# EAGLE design PCB-AuxControl (EAGLE 9.5.2)
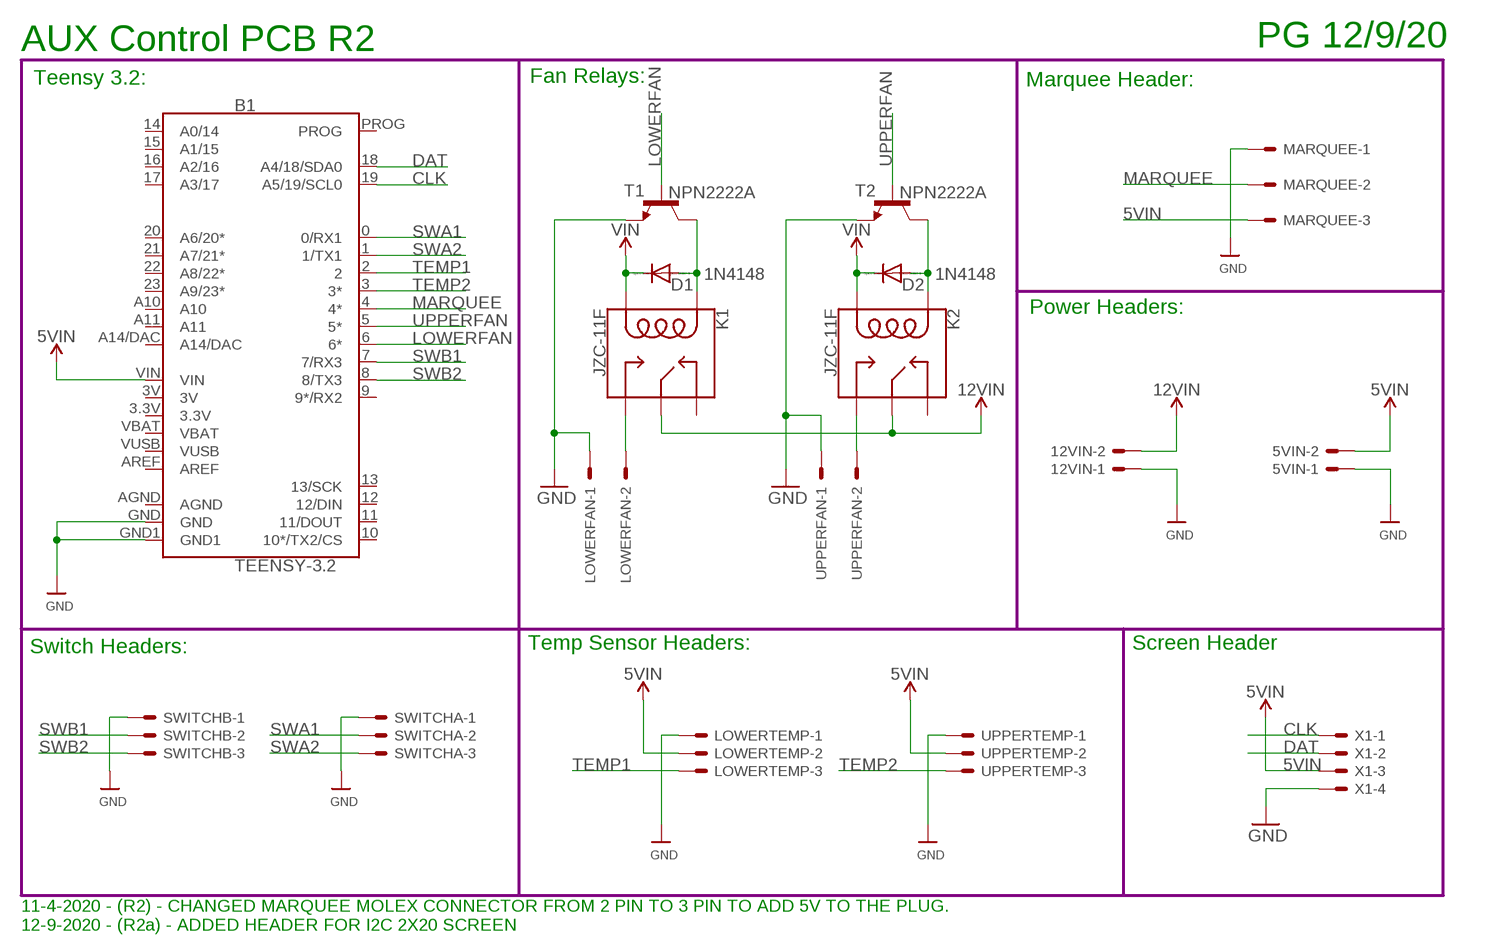
[diagram p0: schematic, sheet 1]

## Parts
5VIN  KK-156-2  [KK-156-2]
12VIN  KK-156-2  [KK-156-2]
B1  TEENSY-3.2  TEENSY-3.1SILK  [TEENSY-3.1]
D1  1N4148  1N4148DO35-7  [DO35-7]
D2  1N4148  1N4148DO35-7  [DO35-7]
K1  JZC-11F  RELAY-SPDT-JZC-11F  [RELAY-JZC]
K2  JZC-11F  RELAY-SPDT-JZC-11F  [RELAY-JZC]
LOWERFAN  KK-156-2  [KK-156-2]
LOWERTEMP  KK-156-3  [KK-156-3]
MARQUEE  KK-156-3  [KK-156-3]
SWITCHA  KK-156-3  [KK-156-3]
SWITCHB  KK-156-3  [KK-156-3]
T1  NPN2222A  BC337  [TO92]
T2  NPN2222A  BC337  [TO92]
UPPERFAN  KK-156-2  [KK-156-2]
UPPERTEMP  KK-156-3  [KK-156-3]
X1  KK-156-4  [KK-156-4]

## Nets
5VIN: 5VIN.2 B1.VIN D1.C D2.C K1.1(COIL2) K2.1(COIL2) LOWERTEMP.2 MARQUEE.3 UPPERTEMP.2 X1.3 ; supply symbol labelled VIN
12VIN: 12VIN.2 K1.4(MAIN) K2.4(MAIN)
CLK: B1.19(A5/19/SCL0) X1.1
DAT: B1.18(A4/18/SDA0) X1.2
GND: 5VIN.1 12VIN.1 B1.GND B1.GND1 LOWERFAN.1 LOWERTEMP.1 MARQUEE.1 SWITCHA.1 SWITCHB.1 T1.1(E) T2.1(E) UPPERFAN.1 UPPERTEMP.1 X1.4
LOWERFAN: B1.6(6*) T1.2(B)
MARQUEE: B1.4(4*) MARQUEE.2
N$3: K2.3(NO) UPPERFAN.2
N$4: K1.3(NO) LOWERFAN.2
RELAY1: D1.A K1.5(COIL1) T1.3(C)
RELAY2: D2.A K2.5(COIL1) T2.3(C)
SWA1: B1.0(0/RX1) SWITCHA.2
SWA2: B1.1(1/TX1) SWITCHA.3
SWB1: B1.7(7/RX3) SWITCHB.2
SWB2: B1.8(8/TX3) SWITCHB.3
TEMP1: B1.2 LOWERTEMP.3
TEMP2: B1.3(3*) UPPERTEMP.3
UPPERFAN: B1.5(5*) T2.2(B)
Unconnected: B1.9(9*/RX2) B1.10(10*/TX2/CS) B1.11(11/DOUT) B1.12(12/DIN) B1.13(13/SCK) B1.14(A0/14) B1.15(A1/15) B1.16(A2/16) B1.17(A3/17) B1.20(A6/20*) B1.21(A7/21*) B1.22(A8/22*) B1.23(A9/23*) B1.A10 B1.A11 B1.A14/DAC B1.AREF B1.PROG K1.2(NC) K2.2(NC)

## Notes on the sheet
- AUX Control PCB R2 | PG 12/9/20
- Teensy 3.2: | Fan Relays: | Marquee Header:
- Power Headers:
- Switch Headers: | Temp Sensor Headers: | Screen Header
- 11-4-2020 - (R2) - CHANGED MARQUEE MOLEX CONNECTOR FROM 2 PIN TO 3 PIN TO ADD 5V TO THE PLUG.
  12-9-2020 - (R2a) - ADDED HEADER FOR I2C 2X20 SCREEN

## Power pins joined to a net without a drawn wire
3.3V: B1.3.3V
3V: B1.3V
AGND: B1.AGND
VBAT: B1.VBAT
VUSB: B1.VUSB

## Library data of the parts
5VIN 12VIN LOWERFAN UPPERFAN = con-molex:KK-156-2: KK 156 HEADER Source: http://www.molex.com/pdm_docs/sd/026604100_sd.pdf; MF: MOLEX; OC_FARNELL: unknown; OC_NEWARK: unknown
B1 = SparkFun-Boards:TEENSY-3.1: Teensy 3+ Footprint Mechanical footprint with connectors for Teensy Development Board with ARM Cortex. SparkFun Products: Teensy 3.2 <https://www.sparkfun.com/products/13736> Teensy LC <https://www.sparkfun.com/products/13305>; SF_ID: DEV-12646
D1 D2 = diode:1N4148: DIODE high speed (Philips)
K1 K2 = SparkFun-Electromechanical:RELAY-SPDT: SPDT Electromechanical Relay Single-pole, double-throw sealed relays. When current is applied to the coil, it throws a simple changeover switch, terminating the connection from the NC contact to ground and closing the NO contact. Use them to switch high voltage/high current devices. SparkFun Products JQX-15F: Relay SPDT Sealed - 20A <https://www.sparkfun.com/products/10924> (COM-10924) JZC-11F: Relay SPDT Sealed <https://www.sparkfun.com/products/100> (COM-00100); PROD_ID: COMP-09533; SF_SKU: COM-00100
LOWERTEMP MARQUEE SWITCHA SWITCHB UPPERTEMP = con-molex:KK-156-3: KK 156 HEADER Source: http://www.molex.com/pdm_docs/sd/026604100_sd.pdf; MF: MOLEX; OC_FARNELL: unknown; OC_NEWARK: unknown
T1 T2 = transistor:BC337: NPN TRANSISTOR
X1 = con-molex:KK-156-4: KK 156 HEADER Source: http://www.molex.com/pdm_docs/sd/026604100_sd.pdf; MF: MOLEX; OC_FARNELL: unknown; OC_NEWARK: unknown

## Board
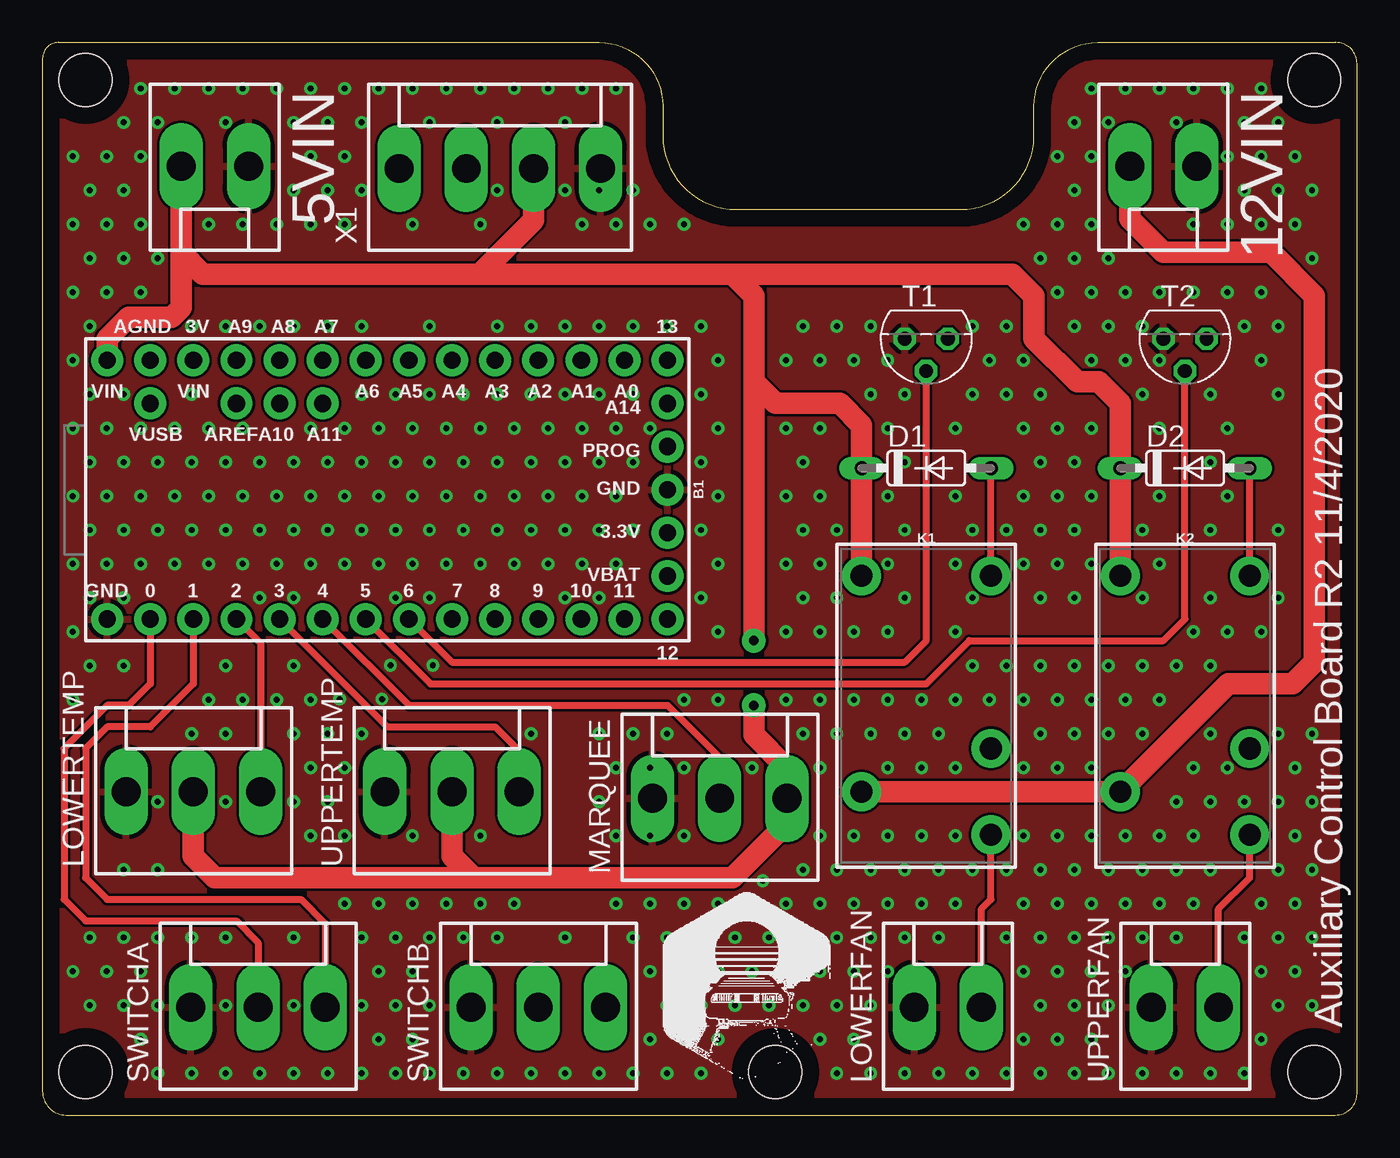
[diagram p1: board, top side]
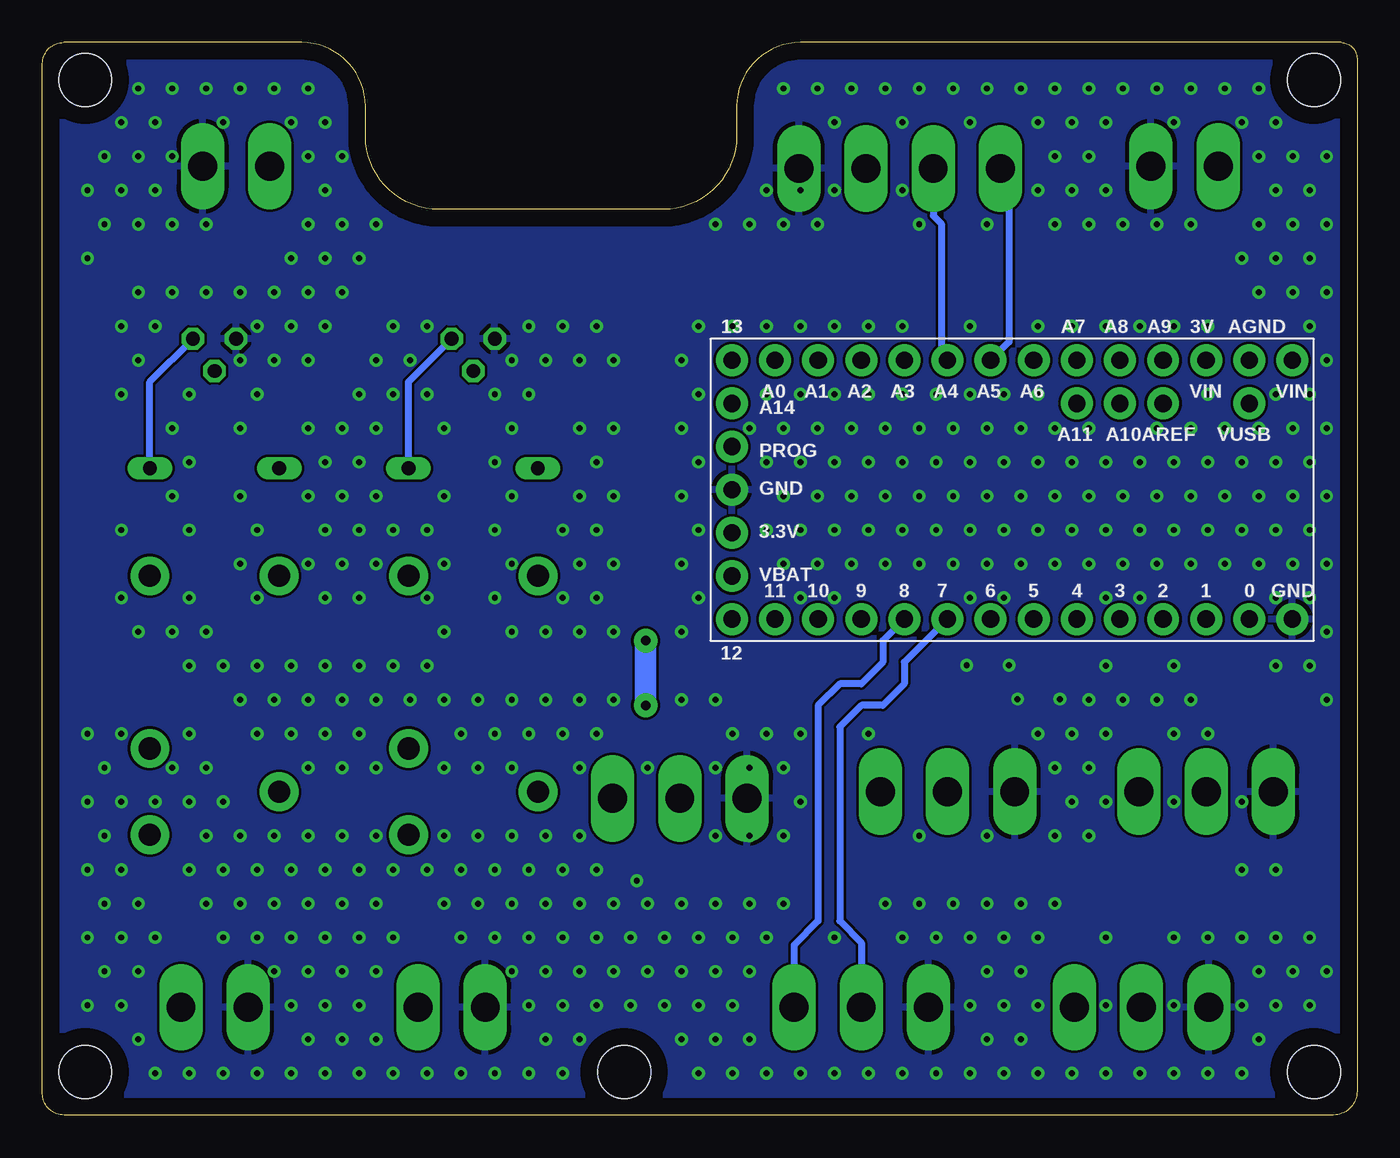
[diagram p2: board, bottom side, seen from below]

Size 77.45 x 63.17 mm. Coordinates in mm from the lower left corner, seen from the top.
Outline: 0,62.23 0,1.4 arc90 1.4,0 76.18,0 arc90 77.45,1.27 77.45,61.92 arc90 76.2,63.17 62.17,63.17 arc90 58.42,59.41 58.42,57.68 arc-90 54.08,53.34 40.89,53.34 arc-90 36.55,57.68 36.55,59.41 arc90 32.8,63.17 0.94,63.17 arc90 0,62.23
Copper layers (1*16): Top 0.035mm / dielectric 1.5mm / Bottom 0.035mm
Design rules "default": minimum track width 6mil, minimum drill 0.35mm, track to track 6mil, track to pad 6mil, pad to pad 6mil, via to via 6mil, smd to smd 6mil, copper to edge 40mil, drill to drill 6mil, minimum pad ring 10mil, minimum via ring 8mil, stop-mask expansion 4mil, vias tented up to drill 0.5mm, thermal gap 10mil
Holes 3.1 mm at 2.54,2.54 74.93,2.54 74.93,60.96 2.54,60.96 43.18,2.54

### Footprints (pad centres in the part's own frame; a part is rotated, then mirrored left to right if it is on the bottom)
KK-156-2 = drill 1.7 pad 2.184 long: 1 -1.98,0; 2 1.98,0
TEENSY-3.1 = drill 1.016 pad 1.88: 0 7.62,-13.97; 1 7.62,-11.43; 2 7.62,-8.89; 3 7.62,-6.35; 3.3V 2.54,16.51; 3V -7.62,-11.43; 4 7.62,-3.81; 5 7.62,-1.27; 6 7.62,1.27; 7 7.62,3.81; 8 7.62,6.35; 9 7.62,8.89; 10 7.62,11.43; 11 7.62,13.97; 12 7.62,16.51; 13 -7.62,16.51; 14 -7.62,13.97; 15 -7.62,11.43; 16 -7.62,8.89; 17 -7.62,6.35; 18 -7.62,3.81; 19 -7.62,1.27; 20 -7.62,-1.27; 21 -7.62,-3.81; 22 -7.62,-6.35; 23 -7.62,-8.89; A10 -5.08,-6.35; A11 -5.08,-3.81; A14/DAC -5.08,16.51; AGND -7.62,-13.97; AREF -5.08,-8.89; GND 0,16.51; GND1 7.62,-16.51; PROG -2.54,16.51; VBAT 5.08,16.51; VIN -7.62,-16.51; VUSB -5.08,-13.97
DO35-7 = drill 0.813 long: A 3.81,0; C -3.81,0
RELAY-JZC = drill 1.3 pad 2.286: 1 3.81,-8.89; 2 -3.81,1.27; 3 -3.81,6.35; 4 3.81,3.81; 5 -3.81,-8.89
KK-156-3 = drill 1.7 pad 2.184 long: 1 -3.96,0; 2 0,0; 3 3.96,0
TO92 = drill 0.813 octagon: 1 1.27,0; 2 0,1.905; 3 -1.27,0
KK-156-4 = drill 1.7 pad 2.184 long: 1 -5.94,0; 2 -1.98,0; 3 1.98,0; 4 5.94,0

### Placement (x,y rotation side)
5VIN  10.16,55.88 180 top
12VIN  66.04,55.88 180 top
B1  20.32,36.83 270 top
D1  52.07,38.1 0 top
D2  67.31,38.1 0 top
K1  52.07,22.86 180 top
K2  67.31,22.86 180 top
LOWERFAN  53.34,6.35 0 top
LOWERTEMP  8.89,19.05 0 top
MARQUEE  39.9,18.65 0 top
SWITCHA  12.7,6.35 0 top
SWITCHB  29.21,6.35 0 top
T1  52.07,45.72 180 top
T2  67.31,45.72 180 top
UPPERFAN  67.31,6.35 0 top
UPPERTEMP  24.13,19.05 0 top
X1  26.95,55.75 0 top

### Tracks (layer width: path | path; a pad name or v marks a point on that pad's centre or on a via)
5VIN  (via drill 0.55 pad 1.4)
  Top 1.27: K2.1 D2.C 63.5,41.91 62.23,43.18 60.96,43.18 58.42,45.72 58.42,48.26 57.15,49.53 40.64,49.53 | K1.1 D1.C 48.26,40.64 46.99,41.91 43.18,41.91 41.91,43.18 | 25.4,13.97 40.64,13.97 43.86,17.19 MARQUEE.3 43.86,20.44 41.91,22.39 v41.91,24.13 | 25.4,13.97 10.16,13.97 8.89,15.24 LOWERTEMP.2 | 41.91,43.18 v41.91,27.94 | 40.64,49.53 41.91,48.26 41.91,43.18 | B1.VIN 3.81,45.72 5.08,46.99 7.62,46.99 8.18,47.55 8.18,50.8 | 5VIN.2 8.18,50.8 | 8.18,50.8 9.45,49.53 25.75,49.53 | 25.75,49.53 40.64,49.53 | UPPERTEMP.2 24.13,15.24 25.4,13.97 | 25.75,49.53 28.93,52.71 X1.3
  Bottom 1.27: v41.91,27.94 v41.91,24.13
12VIN
  Top 1.27: K1.4 K2.4 69.85,25.4 73.66,25.4 74.93,26.67 74.93,48.26 72.39,50.8 66.04,50.8 64.06,52.78 12VIN.2
CLK
  Bottom 0.406: X1.1 21.01,54.26 20.5,53.75 20.5,45.54 B1.19
DAT
  Bottom 0.406: X1.2 24.97,52.97 24.5,52.5 24.5,44.82 B1.18
GND  (via drill 0.35)
  other vias: 42.44,13.8 2.8,6.46 1.8,8.46 2.8,10.46 1.8,24.46 2.8,26.46 1.8,28.46 2.8,30.46 1.8,32.46 2.8,34.46 1.8,36.46 2.8,38.46 1.8,40.46 2.8,42.46 1.8,44.46 2.8,46.46 1.8,48.46 2.8,50.46 1.8,52.46 2.8,54.46 1.8,56.46 4.8,6.46 3.8,8.46 4.8,10.46 4.8,14.46 4.8,26.46 4.8,30.46 3.8,32.46 4.8,34.46 3.8,36.46 4.8,38.46 3.8,40.46 4.8,42.46 3.8,48.46 4.8,50.46 3.8,52.46 4.8,54.46 3.8,56.46 4.8,58.46 6.8,2.46 5.8,4.46 6.8,6.46 5.8,8.46 6.8,10.46 6.8,14.46 6.8,18.46 5.8,32.46 6.8,34.46 5.8,36.46 6.8,38.46 5.8,40.46 5.8,48.46 6.8,50.46 5.8,52.46 5.8,56.46 6.8,58.46 5.8,60.46 8.8,2.46 8.8,10.46 8.8,22.46 7.8,32.46 8.8,34.46 7.8,36.46 8.8,38.46 7.8,40.46 8.8,42.46 8.8,46.46 7.8,60.46 10.8,2.46 10.8,6.46 10.8,10.46 10.8,18.46 10.8,22.46 9.8,24.46 10.8,26.46 9.8,32.46 10.8,34.46 9.8,36.46 10.8,38.46 9.8,40.46 10.8,46.46 9.8,52.46 10.8,58.46 9.8,60.46 12.8,2.46 11.8,24.46 12.8,30.46 11.8,32.46 12.8,34.46 11.8,36.46 12.8,38.46 11.8,40.46 12.8,46.46 11.8,52.46 11.8,60.46 14.8,2.46 14.8,6.46 14.8,10.46 14.8,18.46 14.8,22.46 13.8,24.46 14.8,26.46 14.8,30.46 13.8,32.46 14.8,34.46 13.8,36.46 14.8,38.46 14.8,46.46 13.8,52.46 14.8,54.46 14.8,58.46 13.8,60.46 16.8,2.46 15.8,16.46 16.8,18.46 15.8,20.46 16.8,22.46 15.8,24.46 15.8,32.46 16.8,34.46 15.8,36.46 16.8,38.46 15.8,40.46 16.8,46.46 15.8,52.46 16.8,54.46 15.8,56.46 16.8,58.46 15.8,60.46 18.8,2.46 18.8,6.46 18.8,10.46 17.8,12.46 17.8,16.46 17.8,20.46 18.8,22.46 17.5,24.5 17.8,32.46 18.8,34.46 17.8,36.46 18.8,38.46 17.8,40.46 18.8,42.46 18.8,46.46 17.8,52.46 18.8,54.46 17.8,56.46 18.8,58.46 17.8,60.46 20.8,2.46 19.8,4.46 20.8,6.46 19.8,8.46 20.8,10.46 19.8,12.46 20,24.5 20.5,26.5 20.8,30.46 19.8,32.46 20.8,34.46 19.8,36.46 20.8,38.46 19.8,40.46 20.8,42.46 19.8,60.46 22.8,2.46 21.8,4.46 22.8,6.46 21.8,8.46 22.8,10.46 21.8,12.46 21.8,16.46 23,26.5 22.8,30.46 21.8,32.46 22.8,34.46 21.8,36.46 22.8,38.46 21.8,40.46 22.8,42.46 22.8,46.46 21.8,52.46 22.8,58.46 21.8,60.46 24.8,2.46 24.8,10.46 23.8,12.46 23.8,32.46 24.8,34.46 23.8,36.46 24.8,38.46 23.8,40.46 24.8,42.46 23.8,60.46 26.8,2.46 26.8,10.46 25.8,12.46 25.8,16.46 25.8,32.46 26.8,34.46 25.8,36.46 26.8,38.46 25.8,40.46 26.8,42.46 26.8,46.46 25.8,52.46 26.8,54.46 26.8,58.46 25.8,60.46 28.8,2.46 27.8,12.46 28.8,22.46 27.8,32.46 28.8,34.46 27.8,36.46 28.8,38.46 27.8,40.46 28.8,42.46 28.8,46.46 27.8,60.46 30.8,2.46 30.8,10.46 30.8,30.46 29.8,32.46 30.8,34.46 29.8,36.46 30.8,38.46 29.8,40.46 30.8,42.46 30.8,46.46 30.8,54.46 30.8,58.46 29.8,60.46 32.8,2.46 32.8,18.46 32.8,22.46 32.8,30.46 31.8,32.46 32.8,34.46 31.8,36.46 32.8,38.46 31.8,40.46 32.8,42.46 32.8,46.46 31.8,52.46 32.8,54.46 31.8,60.46 34.8,2.46 34.8,10.46 33.8,12.46 33.8,16.46 33.8,20.46 34.8,22.46 33.8,32.46 34.8,34.46 33.8,36.46 34.8,38.46 33.8,40.46 34.8,42.46 34.8,46.46 33.8,52.46 34.8,54.46 33.8,60.46 36.8,2.46 35.8,4.46 36.8,6.46 35.8,8.46 36.8,10.46 35.8,12.46 35.8,16.46 35.8,20.46 36.8,22.46 35.8,40.46 36.8,46.46 35.8,52.46 38.8,2.46 37.8,4.46 38.8,6.46 37.8,8.46 38.8,10.46 37.8,12.46 37.8,16.46 37.8,20.46 37.8,24.46 38.8,30.46 38.8,34.46 38.8,38.46 38.8,42.46 38.8,46.46 37.8,52.46 39.8,4.46 40.8,6.46 39.8,8.46 40.8,10.46 39.8,12.46 39.8,24.46 39.8,28.46 39.8,32.46 39.8,36.46 39.8,40.46 39.8,44.46 42.8,6.46 41.8,8.46 42.8,10.46 41.8,12.46 41.8,20.46 44.8,6.46 43.8,8.46 44.8,10.46 43.8,12.46 44.8,14.46 44.8,22.46 43.8,24.46 43.8,28.46 44.8,30.46 43.8,32.46 44.8,34.46 43.8,36.46 44.8,38.46 43.8,40.46 43.8,44.46 44.8,46.46 46.8,2.46 45.8,4.46 46.8,6.46 45.8,8.46 46.8,10.46 45.8,12.46 46.8,14.46 45.8,16.46 45.8,20.46 46.8,22.46 45.8,24.46 45.8,28.46 46.8,30.46 45.8,32.46 46.8,34.46 45.8,36.46 45.8,40.46 45.8,44.46 46.8,46.46 48.8,2.46 47.8,4.46 48.8,6.46 47.8,8.46 48.8,10.46 47.8,12.46 48.8,14.46 47.8,16.46 48.8,22.46 47.8,24.46 47.8,28.46 48.8,42.46 47.8,44.46 48.8,46.46 50.8,2.46 49.8,8.46 50.8,10.46 49.8,12.46 50.8,14.46 49.8,16.46 49.8,20.46 50.8,22.46 49.8,24.46 49.8,28.46 50.8,30.46 49.8,32.46 50.8,34.46 49.8,36.46 50.8,38.46 49.8,40.46 50.8,42.46 49.8,44.46 52.8,2.46 52.8,10.46 51.8,12.46 52.8,14.46 51.8,16.46 51.8,20.46 52.8,22.46 51.8,24.46 54.8,2.46 53.8,12.46 54.8,14.46 53.8,16.46 53.8,20.46 53.8,24.46 54.8,26.46 53.8,28.46 54.8,30.46 53.8,32.46 54.8,34.46 53.8,36.46 53.8,40.46 54.8,42.46 54.8,46.46 56.8,2.46 56.8,10.46 56.8,14.46 55.8,24.46 56.8,26.46 56.8,34.46 56.8,42.46 55.8,44.46 56.8,46.46 58.8,2.46 57.8,4.46 58.8,6.46 57.8,8.46 58.8,10.46 57.8,12.46 58.8,14.46 57.8,16.46 57.8,20.46 58.8,22.46 57.8,24.46 58.8,26.46 58.8,30.46 57.8,32.46 58.8,34.46 57.8,36.46 58.8,38.46 57.8,40.46 58.8,42.46 57.8,44.46 58.8,50.46 57.8,52.46 60.8,2.46 59.8,4.46 60.8,6.46 59.8,8.46 60.8,10.46 59.8,12.46 60.8,14.46 59.8,16.46 59.8,20.46 60.8,22.46 59.8,24.46 60.8,26.46 60.8,30.46 59.8,32.46 60.8,34.46 59.8,36.46 60.8,38.46 59.8,40.46 60.8,46.46 59.8,48.46 60.8,50.46 59.8,52.46 60.8,54.46 59.8,56.46 60.8,58.46 62.8,2.46 61.8,4.46 62.8,6.46 61.8,8.46 62.8,10.46 61.8,12.46 62.8,14.46 61.8,16.46 61.8,20.46 62.8,22.46 61.8,24.46 62.8,26.46 61.8,32.46 61.8,36.46 61.8,40.46 61.8,44.46 62.8,46.46 61.8,48.46 62.8,50.46 61.8,52.46 61.8,56.46 62.8,58.46 61.8,60.46 64.8,2.46 63.8,8.46 64.8,10.46 63.8,12.46 64.8,14.46 63.8,16.46 64.8,22.46 63.8,24.46 64.8,26.46 64.8,30.46 64.8,34.46 64.8,42.46 63.8,44.46 64.8,46.46 63.8,48.46 63.8,60.46 66.8,2.46 66.8,10.46 65.8,12.46 66.8,14.46 65.8,16.46 66.8,18.46 65.8,24.46 66.8,26.46 65.8,32.46 65.8,36.46 65.8,40.46 65.8,44.46 65.8,48.46 66.8,58.46 65.8,60.46 68.8,2.46 67.8,12.46 68.8,14.46 67.8,16.46 68.8,18.46 67.8,20.46 68.8,22.46 68.8,26.46 67.8,28.46 68.8,30.46 68.8,34.46 68.8,38.46 68.8,42.46 67.8,48.46 67.8,52.46 67.8,60.46 70.8,2.46 70.8,10.46 70.8,18.46 69.8,20.46 69.8,28.46 69.8,36.46 69.8,40.46 70.8,46.46 69.8,48.46 69.8,52.46 70.8,54.46 69.8,56.46 70.8,58.46 69.8,60.46 71.8,4.46 72.8,6.46 71.8,8.46 72.8,10.46 71.8,12.46 72.8,14.46 72.8,18.46 72.8,22.46 71.8,28.46 72.8,30.46 72.8,34.46 72.8,42.46 71.8,44.46 72.8,46.46 71.8,48.46 71.8,52.46 72.8,54.46 71.8,56.46 72.8,58.46 71.8,60.46 74.8,6.46 73.8,8.46 74.8,10.46 73.8,12.46 74.8,14.46 73.8,16.46 74.8,18.46 73.8,20.46 74.8,22.46 74.8,50.46 73.8,52.46 74.8,54.46 73.8,56.46
  pour Top: 0,0 0,63.5 77.47,63.5 77.47,0
  pour Bottom: 0,0 0,63.5 77.47,63.5 77.47,0
LOWERFAN
  Top 0.406: B1.6 24.13,26.67 50.8,26.67 52.07,27.94 T1.2
MARQUEE
  Top 0.406: B1.4 21.59,24.13 36.83,24.13 39.9,21.06 MARQUEE.2
N$3
  Top 0.406: UPPERFAN.2 69.29,12.14 71.12,13.97 K2.3
N$4
  Top 0.406: LOWERFAN.2 55.32,12.14 55.88,12.7 K1.3
RELAY1
  Top 0.406: K1.5 D1.A
  Bottom 0.406: D1.A 55.88,43.18 T1.3
RELAY2
  Top 0.406: K2.5 D2.A
  Bottom 0.406: D2.A 71.12,43.18 T2.3
SWA1
  Top 0.406: B1.0 6.35,25.4 5.08,24.13 3.81,24.13 1.27,21.59 1.27,12.7 2.54,11.43 11.43,11.43 12.7,10.16 SWITCHA.2
SWA2
  Top 0.406: B1.1 8.89,25.4 6.35,22.86 3.81,22.86 2.54,21.59 2.54,13.97 3.81,12.7 15.24,12.7 16.66,11.28 SWITCHA.3
SWB1
  Bottom 0.406: B1.7 26.67,26.67 26.67,25.4 27.94,24.13 29.21,24.13 30.48,22.86 30.48,11.43 29.21,10.16 SWITCHB.2
SWB2
  Bottom 0.406: B1.8 27.94,27.94 27.94,26.67 29.21,25.4 30.48,25.4 31.75,24.13 31.75,11.43 33.17,10.01 SWITCHB.3
TEMP1
  Top 0.406: B1.2 12.85,27.79 LOWERTEMP.3
TEMP2
  Top 0.406: B1.3 20.32,22.86 26.67,22.86 27.94,21.59 27.94,20.47 28.09,20.32 UPPERTEMP.3
UPPERFAN
  Top 0.406: B1.5 22.86,25.4 52.07,25.4 54.61,27.94 66.04,27.94 67.31,29.21 T2.2

### Text on the board
tNames: Auxiliary Control Board R2 11/4/2020
Reference: 11-4-2020 - (R2) - CHANGED MARQUEE / MOLEX FROM 2 PIN TO 3 PIN TO ADD / 5V TO HEADER. 5VIN WAS CHANGED / FROM .8068 THICKNESS TO 1.27 FOR / ADDITIONAL POWER NEEDS / 12-9-2020 - (R2a) - ADDED HEADER FOR I2C 2X20 SCREEN